# EAGLE design light_controller (EAGLE 9.6.2)
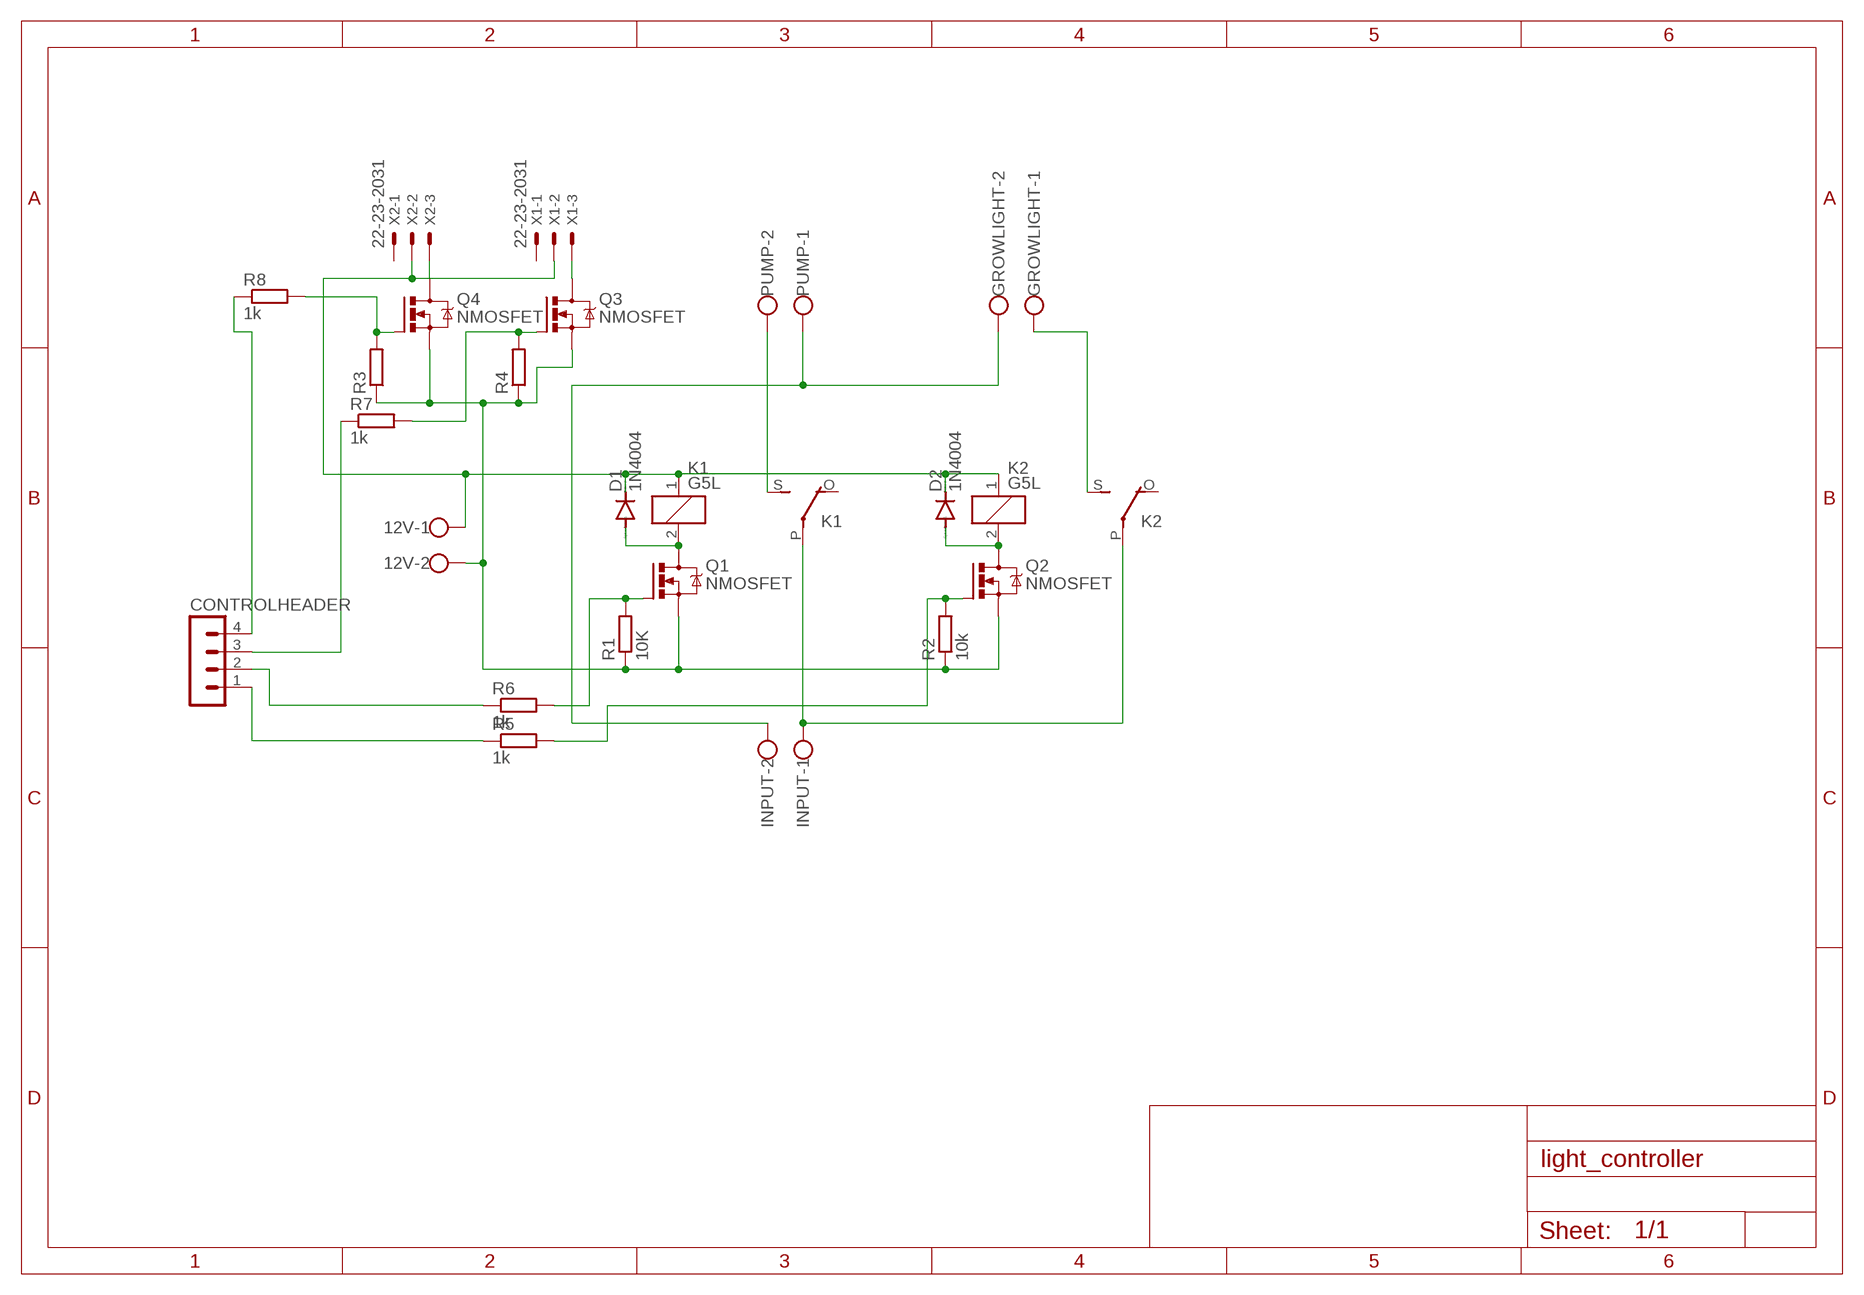
[diagram p0: schematic, sheet 1]

## Parts
12V  W237-102  [W237-102]
CONTROLHEADER  MA04-1  [MA04-1]
D1  1N4004  [DO41-10]
D2  1N4004  [DO41-10]
GROWLIGHT  W237-102  [W237-102]
INPUT  W237-102  [W237-102]
K1  G5L  [G5LE]
K2  G5L  [G5LE]
PUMP  W237-102  [W237-102]
Q1  NMOSFET  NMOSFET_TO220  [TO220BV]
Q2  NMOSFET  NMOSFET_TO220  [TO220BV]
Q3  NMOSFET  NMOSFET_TO220  [TO220BV]
Q4  NMOSFET  NMOSFET_TO220  [TO220BV]
R1  10K  R-EU_0204/7  [0204/7]
R2  10k  R-EU_0204/7  [0204/7]
R3  R-EU_0204/7  [0204/7]
R4  R-EU_0204/7  [0204/7]
R5  1k  R-EU_0204/7  [0204/7]
R6  1k  R-EU_0204/7  [0204/7]
R7  1k  R-EU_0204/7  [0204/7]
R8  1k  R-EU_0204/7  [0204/7]
X1  22-23-2031  [22-23-2031]
X2  22-23-2031  [22-23-2031]

## Nets
N$1: D1.A K1.2 Q1.D
N$2: INPUT.1 K1.P(2:P) K2.P(2:P)
N$3: K1.S(2:S) PUMP.2
N$4: GROWLIGHT.2 INPUT.2 PUMP.1
N$5: 12V.1 D1.C D2.C K1.1 K2.1 X1.2 X2.2
N$6: 12V.2 Q1.S Q2.S Q3.S Q4.S R1.1 R2.1 R3.1 R4.1
N$7: Q1.G R1.2 R6.2
N$8: D2.A K2.2 Q2.D
N$9: Q2.G R2.2 R5.2
N$10: Q4.G R3.2 R8.2
N$11: GROWLIGHT.1 K2.S(2:S)
N$12: Q3.G R4.2 R7.2
N$13: CONTROLHEADER.1 R5.1
N$14: CONTROLHEADER.2 R6.1
N$15: Q4.D X2.3
N$16: Q3.D X1.3
N$17: CONTROLHEADER.3 R7.1
N$18: CONTROLHEADER.4 R8.1
Unconnected: K1.O(2:O) K2.O(2:O) X1.1 X2.1

## Library data of the parts
12V GROWLIGHT INPUT PUMP = con-wago-500:W237-102: WAGO SCREW CLAMP; MPN: 237-102; OC_FARNELL: unknown; OC_NEWARK: 70K9898
CONTROLHEADER = con-lstb:MA04-1: PIN HEADER; OC_FARNELL: unknown; OC_NEWARK: unknown
D1 D2 = diode:1N4004: DIODE general purpose rectifier, 1 A
K1 K2 = relay:G5L: RELAY 1 x switch, 10 A/120 V AC, 8 A/30 V ADC, Omron; OC_FARNELL: unknown; OC_NEWARK: unknown
Q1-Q4 = Transistor:NMOSFET: N-Channel MOSFET - Generic; CATEGORY: Transistor; SUB-CATEGORY: MOSFET; TYPE: N-Channel
R1-R8 = rcl:R-EU_: RESISTOR, European symbol; SPICEPREFIX: R
X1 X2 = con-molex:22-23-2031: .100" (2.54mm) Center Header - 3 Pin; MF: MOLEX; MPN: 22-23-2031; OC_FARNELL: 1462950; OC_NEWARK: 30C0862

## Net classes
0 default: width 0.254 mm, drill 0.3 mm, clearance 0.254 mm

## Board
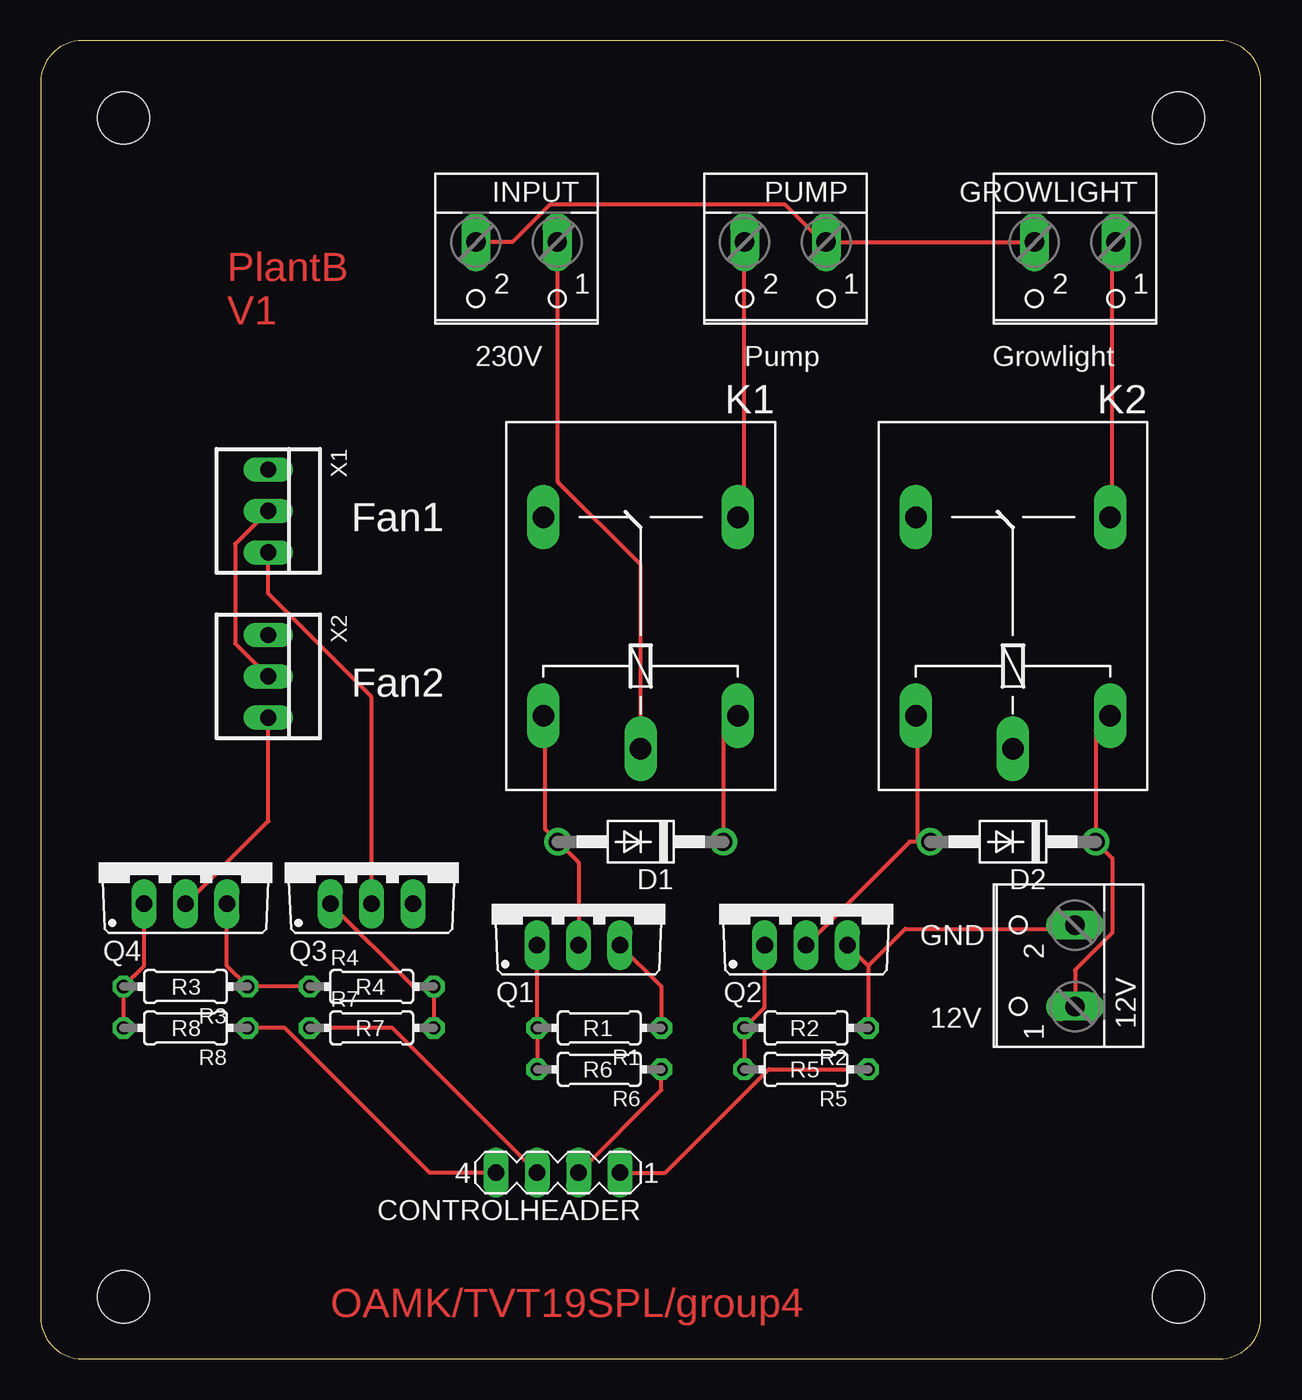
[diagram p1: board, top side]
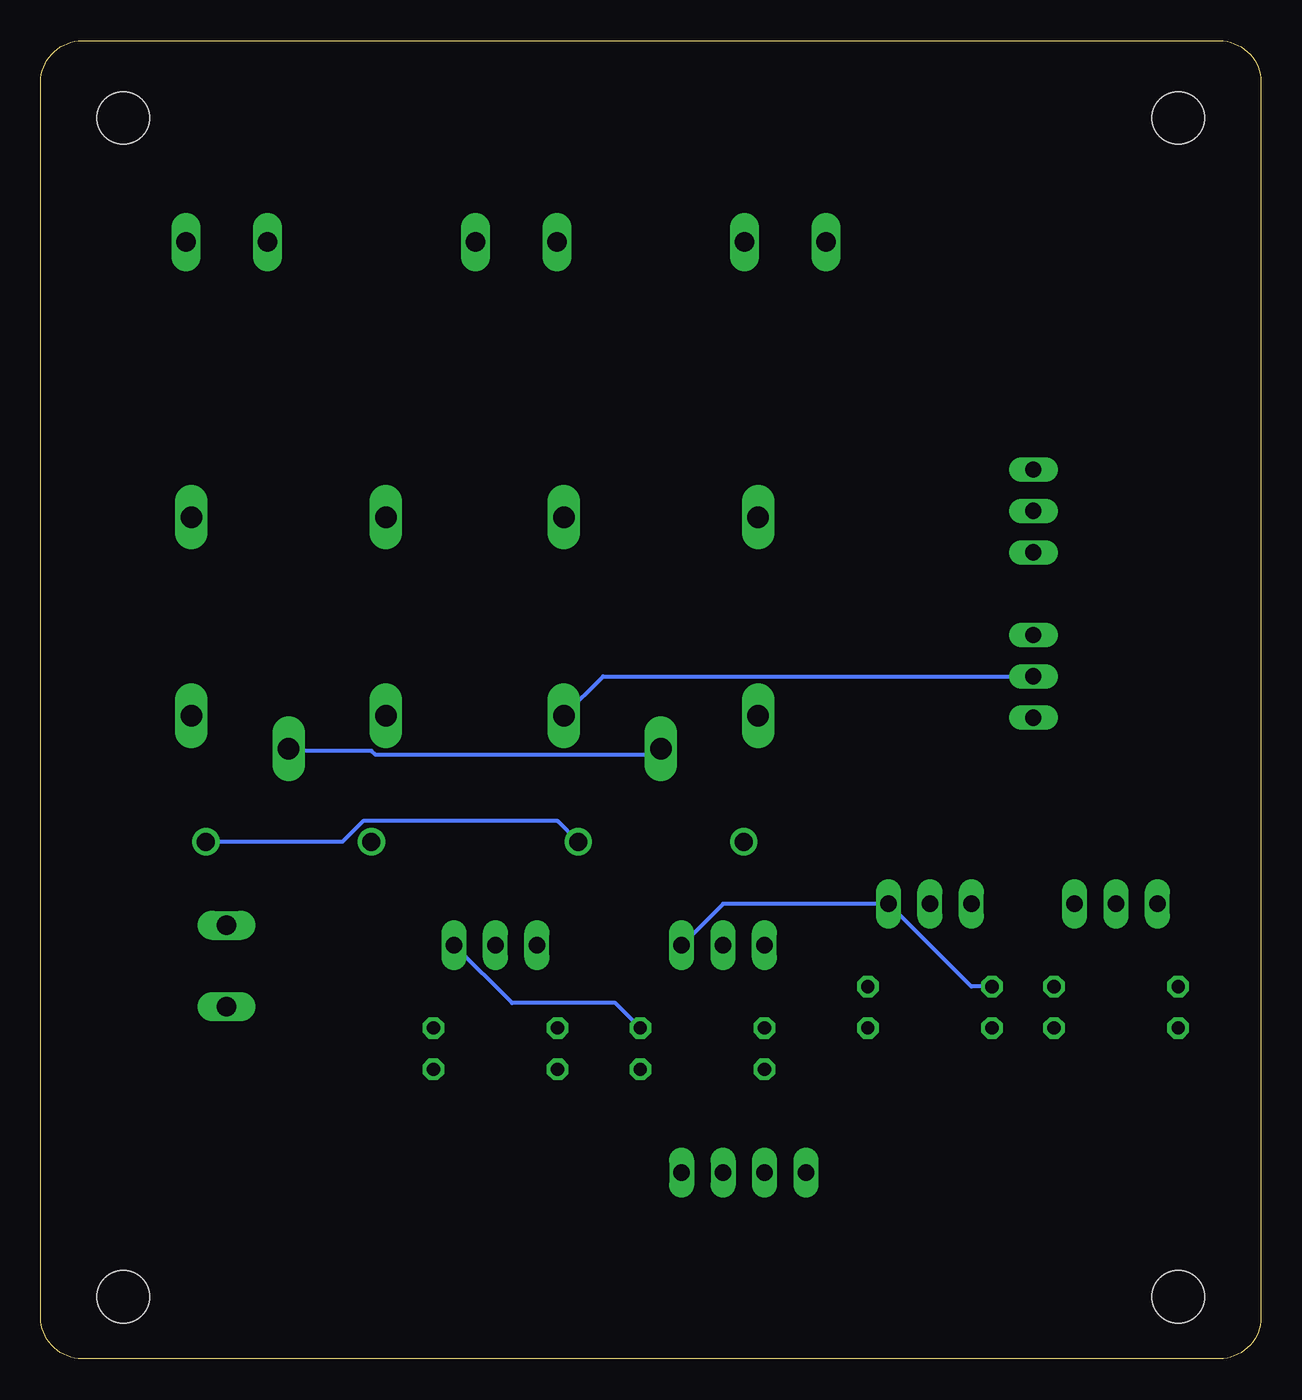
[diagram p2: board, bottom side, seen from below]

Size 74.91 x 80.95 mm. Coordinates in mm from the lower left corner, seen from the top.
Outline: 74.91,2.54 74.91,78.41 arc90 72.37,80.95 2.54,80.95 arc90 0,78.41 0,2.54 arc90 2.54,0 72.37,0 arc90 74.91,2.54
Copper layers (1*16): Top 0.035mm / dielectric 1.5mm / Bottom 0.035mm
Design rules "light_controller *": minimum track width 10mil, minimum drill 0.35mm, track to track 10mil, track to pad 10mil, pad to pad 10mil, via to via 10mil, smd to smd 10mil, copper to edge 40mil, drill to drill 6mil, minimum pad ring 10mil, minimum via ring 8mil, stop-mask expansion 4mil, vias tented up to drill 0mil, thermal gap 10mil
Holes 3.2 mm at 5.08,3.81 69.85,3.81 5.08,76.2 69.85,76.2

### Footprints (pad centres in the part's own frame; a part is rotated, then mirrored left to right if it is on the bottom)
W237-102 = drill 1.194 long: 1 -2.5,-1.27; 2 2.5,-1.27
MA04-1 = drill 1.016 long: 1 -3.81,0; 2 -1.27,0; 3 1.27,0; 4 3.81,0
DO41-10 = drill 1.118: A 5.08,0; C -5.08,0
G5LE = drill 1.321 long: 1 -7.493,-5.969; 2 -7.493,5.969; O 4.699,5.969; P -9.525,0; S 4.699,-5.969
TO220BV = drill 1.016 long: D 0,-2.54; G -2.54,-2.54; S 2.54,-2.54
0204/7 = drill 0.813 octagon: 1 -3.81,0; 2 3.81,0
22-23-2031 = drill 1 long: 1 -2.54,0; 2 0,0; 3 2.54,0

### Placement (x,y rotation side)
12V  62.23,24.13 90 top
CONTROLHEADER  31.75,11.43 180 top
D1  36.83,31.75 180 top
D2  59.69,31.75 180 top
GROWLIGHT  63.5,67.31 180 top
INPUT  29.21,67.31 180 top
K1  36.83,46.99 90 top
K2  59.69,46.99 90 top
PUMP  45.72,67.31 180 top
Q1  33.02,27.94 0 top
Q2  46.99,27.94 0 top
Q3  20.32,30.48 0 top
Q4  8.89,30.48 0 top
R1  34.29,20.32 180 top
R2  46.99,20.32 180 top
R3  8.89,22.86 180 top
R4  20.32,22.86 0 top
R5  46.99,17.78 180 top
R6  34.29,17.78 180 top
R7  20.32,20.32 0 top
R8  8.89,20.32 180 top
X1  13.97,52.07 270 top
X2  13.97,41.91 270 top

### Tracks (layer width: path | path; a pad name or v marks a point on that pad's centre or on a via)
N$1
  Top 0.254: Q1.D 33.02,30.48 D1.A 30.99,32.51 30.99,39.37 K1.2
N$2
  Top 0.254: K1.P 36.83,48.77 31.75,53.85 31.75,68.58 INPUT.1
  Bottom 0.254: K2.P 59.69,37.34 54.61,37.34 54.36,37.08 37.08,37.08 36.83,37.34 K1.P
N$3
  Top 0.254: K1.S 43.18,52.07 43.18,68.58 PUMP.2
N$4
  Top 0.254: INPUT.2 28.96,68.58 31.24,70.87 45.72,70.87 48.01,68.58 PUMP.1 GROWLIGHT.2
N$5
  Top 0.254: K2.1 64.77,38.61 D2.C 65.79,30.73 65.79,26.16 63.5,23.88 12V.1 | X2.2 11.94,43.94 11.94,50.04 X1.2 | D1.C 41.91,38.61 K1.1
  Bottom 0.254: X2.2 40.39,41.91 K1.1 | D2.C 56.39,31.75 55.12,33.02 43.18,33.02 D1.C
N$6
  Top 0.254: 50.8,24.13 R2.1 | Q2.S 50.8,24.13 | 50.8,24.13 53.09,26.42 63.5,26.42 12V.2 | R1.1 38.1,22.86 Q1.S | R4.1 R3.1 11.43,24.13 Q4.S
  Bottom 0.254: R4.1 17.78,22.86 Q3.S 33.02,27.94 Q1.S | Q2.S 45.97,21.84 39.62,21.84 R1.1
N$7
  Top 0.254: R6.2 R1.2 Q1.G
N$8
  Top 0.254: Q2.D 53.34,31.75 53.85,31.75 | 53.85,31.75 53.85,39.37 K2.2 | 53.85,31.75 D2.A
N$9
  Top 0.254: R5.2 R2.2 44.45,21.59 Q2.G
N$10
  Top 0.254: R8.2 R3.2 6.35,24.13 Q4.G
N$11
  Top 0.254: GROWLIGHT.1 65.79,68.58 65.79,51.82 K2.S
N$12
  Top 0.254: R7.2 R4.2 22.86,22.86 Q3.G
N$13
  Top 0.254: R5.1 44.7,17.78 38.35,11.43 CONTROLHEADER.1
N$14
  Top 0.254: R6.1 38.1,16.51 CONTROLHEADER.2
N$15
  Top 0.254: X2.3 13.97,33.02 Q4.D
N$16
  Top 0.254: X1.3 13.97,46.99 20.32,40.64 Q3.D
N$17
  Top 0.254: R7.1 21.59,20.32 CONTROLHEADER.3
N$18
  Top 0.254: R8.1 14.99,20.32 23.88,11.43 CONTROLHEADER.4

### Text on the board
Top: PlantB / V1 | OAMK/TVT19SPL/group4
tPlace: 230V | Pump | Growlight | Fan1 | Fan2 | GND | R3 | R4 | R8 | R7 | R1 | R2 | 12V | R6 | R5